# Altium schematic sheet nguyenli.SchDoc
size A
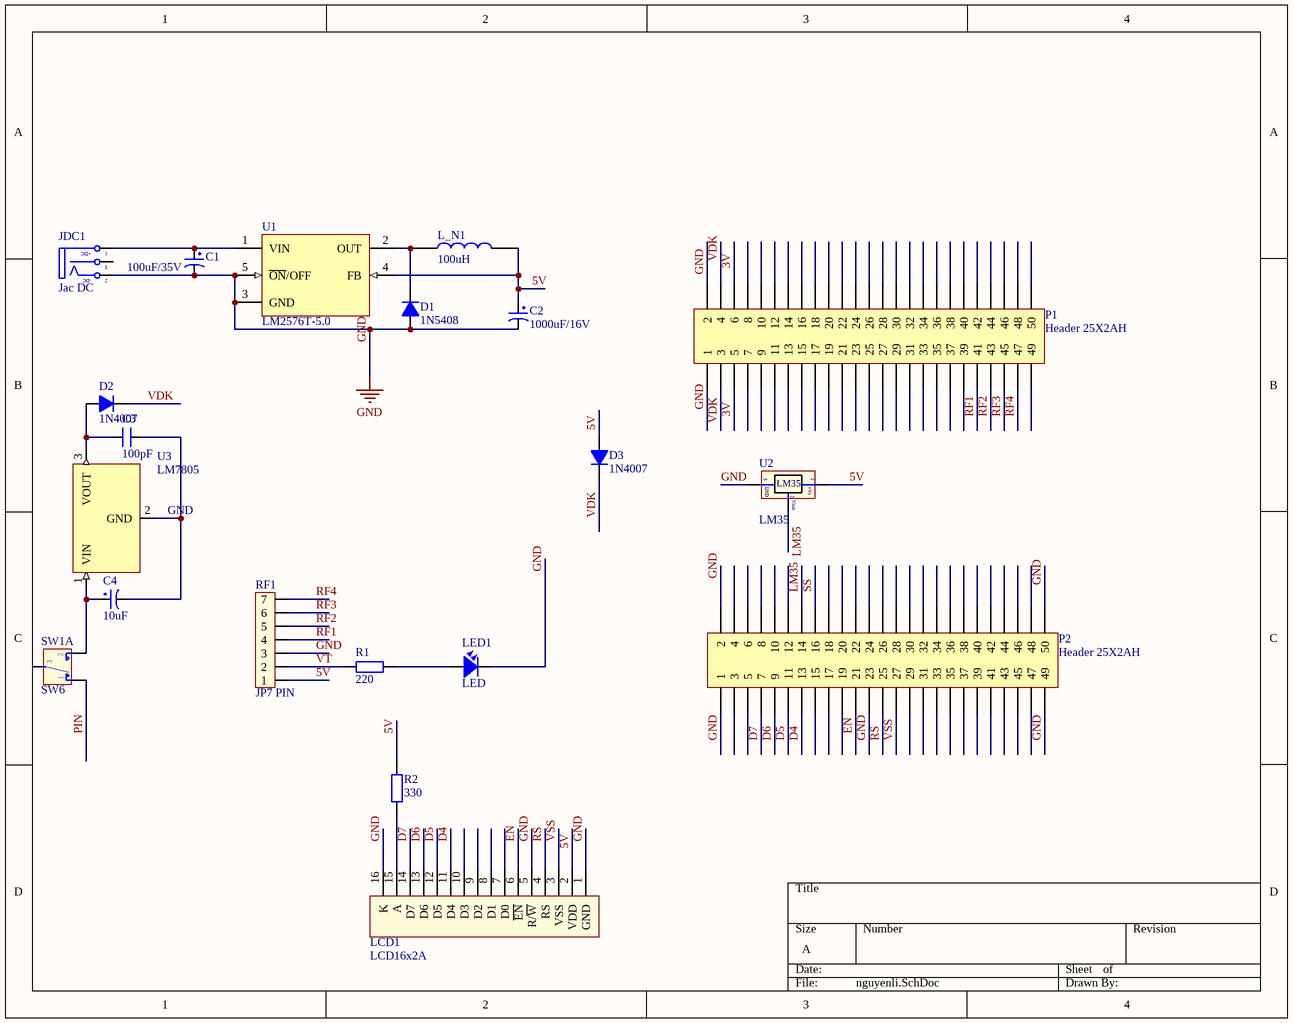
[diagram p0: nguyenli.SchDoc]

## Parts
C1  100uF/35V  [CP1.5/3.4]
C2  1000uF/16V  [CP1.5/3.4]
C3  100pF  [CN1]
C4  10uF  [CP1/2]
D1  1N5408  [D5A]
D2  1N4007  [D1A]
D3  1N4007  [D1A]
JDC1  Jac DC  [DC-IN]
L_N1  100uH  [100UH]
LCD1  LCD16x2A  [LCD16X2]
LED1  LED  [LED-3]
P1  Header 25X2AH  [HDR2X25]
P2  Header 25X2AH  [HDR2X25]
R1  220  [R1/4W]
R2  330  [R1/4W]
RF1  JP7 PIN  [JP7]
SW1  SW6  [SW6]  (part A of 2)
U1  LM2576T-5.0  [LM2576t]
U2  LM35  [QTO-92]
U3  LM7805  [QTO-220H3]

## Nets
GND: C1.2 C2.2 D1.1(A) JDC1.2(TN) LCD1.1(GND) LCD1.5(R/~{W}) LCD1.16(K) LED1.2 P1.1 P1.2 P2.1 P2.2 P2.23 P2.49 P2.50 RF1.3 U1.3(GND) U1.5(~{ON}/OFF) U2.3(-)
3V: P1.5 P1.6
5V: C2.1 D3.1(A) L_N1.2 LCD1.2(VDD) R2.2 RF1.1 U1.4(FB) U2.1(+Vs)
D4: LCD1.11(D4) P2.13
D5: LCD1.12(D5) P2.11
D6: LCD1.13(D6) P2.9
D7: LCD1.14(D7) P2.7
EN: LCD1.6(~{EN}) P2.21
LM35: P2.14 U2.2(Vout)
PIN: SW1.1
RF1: P1.41 RF1.4
RF2: P1.43 RF1.5
RF3: P1.45 RF1.6
RF4: P1.47 RF1.7
RS: LCD1.4(RS) P2.25
SS: P2.16
VDK: D2.2(K) D3.2(K) P1.3 P1.4
VSS: LCD1.3(VSS) P2.27
VT: R1.2 RF1.2
NetC1_1: C1.1 JDC1.1(T) U1.1(VIN)
NetC3_1: C3.1 D2.1(A) U3.3(VOUT)
NetC3_2: C3.2 C4.2 U3.2(GND)
NetC4_1: C4.1 SW1.2 U3.1(VIN)
NetD1_2: D1.2(K) L_N1.1 U1.2(OUT)
NetLCD1_15: LCD1.15(A) R2.1
NetLED1_1: LED1.1 R1.1

Not connected (* = marked no-connect by the designer): JDC1 3(S); LCD1 7(D0) 8(D1) 9(D2) 10(D3); P1 7 8 9 10 11 12 13 14 15 16 17 18 19 20 21 22 23 24 25 26 27 28 29 30 31 32 33 34 35 36 37 38 39 40 42 44 46 48 49 50; P2 3 4 5 6 8 10 12 15 17 18 19 20 22 24 26 28 29 30 31 32 33 34 35 36 37 38 39 40 41 42 43 44 45 46 47 48; SW1 3

## Notes on the sheet
- (near U3) GND
- (in symbol DCIN) +DC; -DC
- (in symbol LM35) GND

## Library data of the parts
C1 = CP3: Cap 100uF/35V - 470uF/16V; Value: 100uF/35V/50V; Description 1: 1000uF/6,3V - 470uF/16V - 330uF - 25V; Description 2: 220uF/35V - 100uF/50V - 63V - 4,7uF/200V; Description 3: 22uF => 33uF100V - 3,3uF => 4,7uF/250V; Description 4: 2,2uF =>3,3uF/350 - 2,2uF/400V - 1uF/450V
C2 = CP4: Cap 1000uF/16V - 220uF/50V; Description 5: 4,7uF>10uF/250V_3,3uF>10uF/400V - 2,2uF>4,7uF/450V; Description 1: 2200uF-3300uF/6,3V - 1000uF-2200uF/10V; Description 2: 1000uF/16V - 470uF => 1000uF/25V - 100uF/100V; Description 3: 330uF>470uF/35V_220uF>470uF/50V_10uF>22uF/250V; Description 4: 220uF => 330uF/63V - 10uF =>33uF/160 - 200V; Value: 1000uF/16V
C3 = CN1: Cap np  1pF - 472pF; Value: 100pF
C4 = CP1: Cap P  0,1uF < 22uF , 16 - 50V; Value: 10uF/50V; Description 1: 10 => 220uF/6,3V/10V - 10uF => 100uF/16V; Description 2: 0,1uF => 33uF/50V - 10uF => 22uF/63V; Description 3: 0,47uF => 10uF/100V
D1 = D5A: Diode 5A; Value: 1N5408
D2 D3 = D1A: Diode 1A; Value: 1N4007
JDC1 = DCIN: Jac DC input; Value: Jac DC
L_N1 = INDUCTOR1
LCD1 = LCD16x2: LCD dipslay 16 char, 2 line; Value: LCD16x2A
LED1 = LED: LED Single colour Green and Red; Value: LED 3 ly Single Colour
P1 P2 = Header 25X2AH: Header, 25-Pin, Dual row; LatestRevisionDate: 17-Jul-2002; LatestRevisionNote: Re-released for DXP Platform.; Publisher: Altium Limited
R1 R2 = R1/4W: Resistor 1/4W; Value: R1/4W - 1K
RF1 = JP7: Value: JP7
SW1 = SW6: SW-DTDP - 6 Pin; Value: SW6
U1 = LM2576T-5.0: SIMPLE SWITCHER; 3A Step-Down Voltage Regulator; Manufacturer: National Semiconductor; PackageTopMarking: NSUZXYTT*LM2576T*-5.0 P+; PowerWise: N; FirstPublished: 4-Dec-2008; DatasheetVersion: Aug-2004; PackageVersion: revJ, Jan-1992; PackageReference: T05A; Publisher: Altium Limited; PackageDescription: TO-220, Molded, 5 Lead, Straight; CompType: Switcher; PartNumber: LM2576T-5.0; RoHS: O; PinCount: 5; DigiKeyPartNumber: LM2576T-5.0-ND; Code_JEDEC: TO-220-AB; ComponentLink1Description: LM2576 Datasheet; ComponentLink1URL: http://www.national.com/ds/LM/LM2576.pdf; ComponentLink2Description: LM2576 Web Page; ComponentLink2URL: http://www.national.com/pf/LM/LM2576.html; ComponentLink3Description: T05A Package Page; ComponentLink3URL: http://www.national.com/packaging/folders/t05a.html
U2 = LM35: Teminal; Value: LM35
U3 = LM7805: TO-220; Text Field1: 70; Text Field2: 30